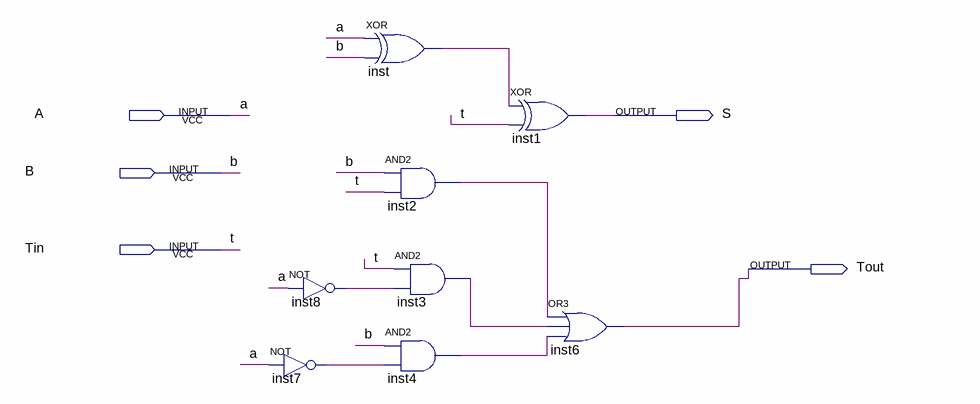
[diagram p0: schematic sheet]
// Quartus schematic subtrator.bdf as structural Verilog: 8 symbols, 5 pins
module subtrator (
  input  A,
  input  B,
  input  Tin,
  output S,
  output Tout
);

  wire inst2_out, inst3_out, inst4_out, inst7_out, inst8_out, inst_out;

  not inst8 (inst8_out, A);
  not inst7 (inst7_out, A);
  xor inst (inst_out, A, B);
  and inst2 (inst2_out, B, Tin);
  and inst3 (inst3_out, Tin, inst8_out);
  and inst4 (inst4_out, B, inst7_out);
  xor inst1 (S, inst_out, Tin);
  or inst6 (Tout, inst2_out, inst3_out, inst4_out);

  // Other names for the same wires on the sheet: t = Tin
endmodule
